# Altium schematic sheet iir_mcu.SchDoc
size A4; SheetNumber: 2; SheetTotal: 2
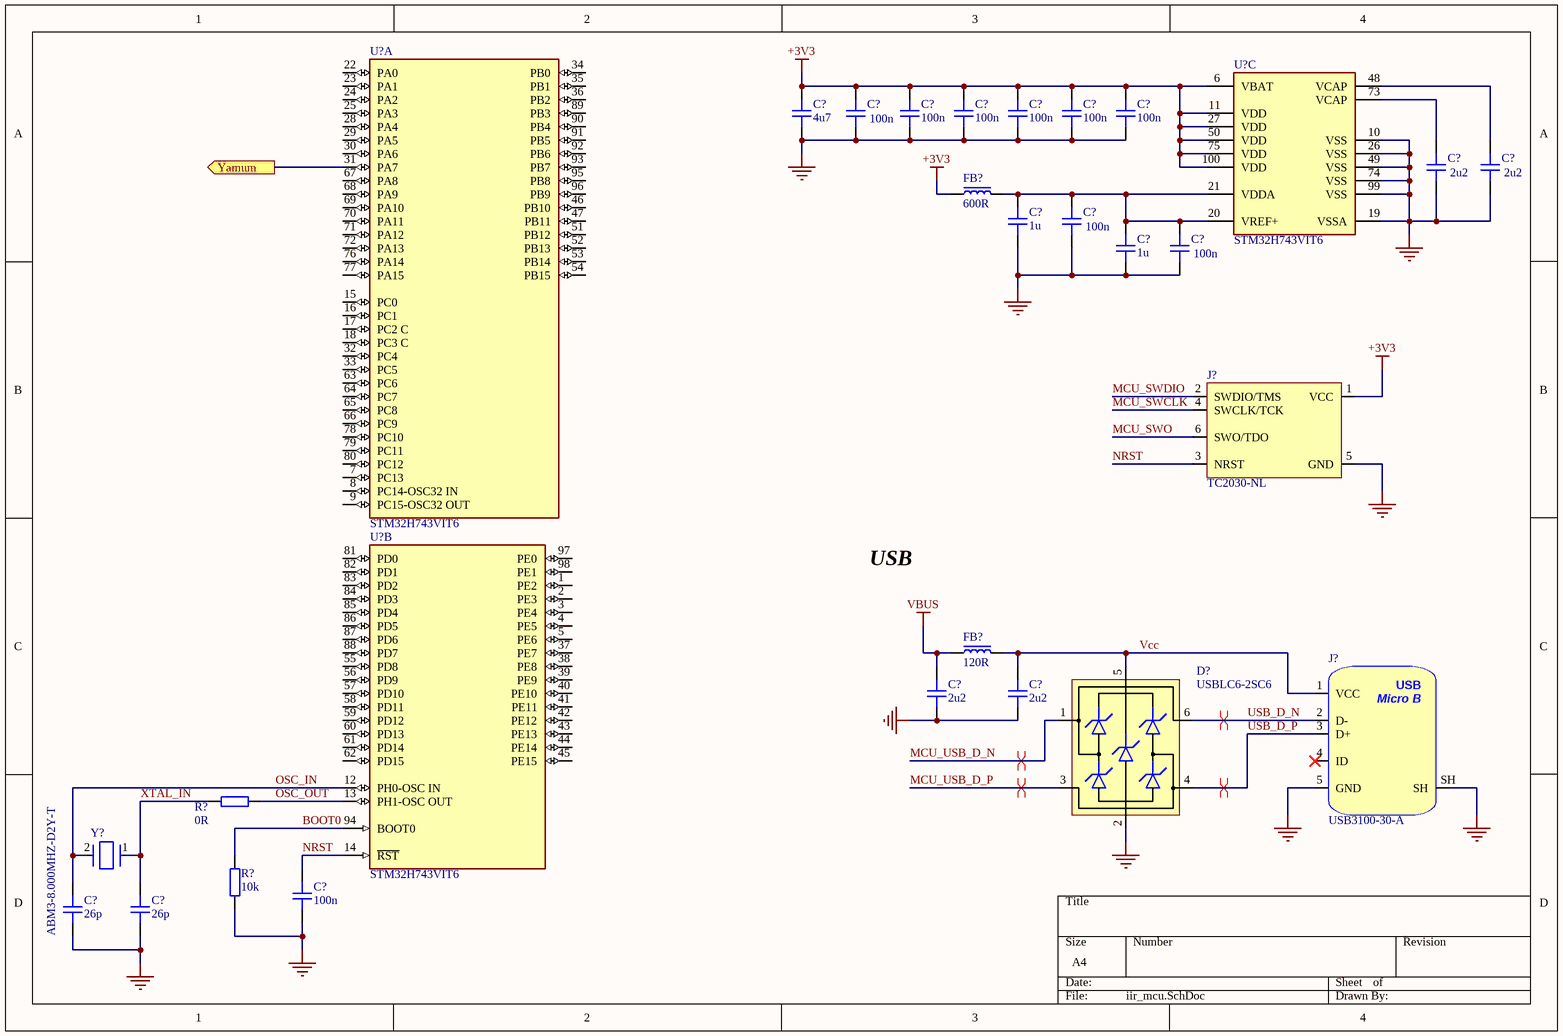
[diagram p0: iir_mcu.SchDoc]

## Parts
(Parts that share a designator on the sheet are numbered #1, #2 ... from top to bottom, then left to right.)
C?#1  4u7  [CAP_0603]
C?#2  100n  [CAP_0402]
C?#3  100n  [CAP_0402]
C?#4  100n  [CAP_0402]
C?#5  100n  [CAP_0402]
C?#6  100n  [CAP_0402]
C?#7  100n  [CAP_0402]
C?#8  2u2  [CAP_0402]
C?#9  2u2  [CAP_0402]
C?#10  1u  [CAP_0603]
C?#11  100n  [CAP_0402]
C?#12  1u  [CAP_0603]
C?#13  100n  [CAP_0402]
C?#14  2u2  [CAP_0603]
C?#15  2u2  [CAP_0603]
C?#16  100n  [CAP_0402]
C?#17  26p  [CAP_0402]
C?#18  26p  [CAP_0402]
D?  USBLC6-2SC6  [SOT-23-6]
FB?#1  600R  [FB_0805]
FB?#2  120R  [FB_0603]
J?#1  TC2030-NL  [TC2030-NL-FP]  (no BOM)
J?#2  USB3100-30-A  [USB3100-30-A]
R?#1  0R  [RES_0402]
R?#2  10k  [RES_0402]
U?#1  STM32H743VIT6  [FP-LQFP100-1L-MFG]  (part A of 3)
U?#2  STM32H743VIT6  [FP-LQFP100-1L-MFG]  (part C of 3)
U?#3  STM32H743VIT6  [FP-LQFP100-1L-MFG]  (part B of 3)
Y?  ABM3-8.000MHZ-D2Y-T  [FP-ABM3-MFG]

## Ports
Yamum (out)

## Nets
+3V3: C?#1.2 C?#2.2 C?#3.2 C?#4.2 C?#5.2 C?#6.2 C?#7.2 FB?#1.1 J?#1.1(VCC) U?#2.6(VBAT) U?#2.11(VDD) U?#2.27(VDD) U?#2.50(VDD) U?#2.75(VDD) U?#2.100(VDD)
GND: C?#1.1 C?#2.1 C?#3.1 C?#4.1 C?#5.1 C?#6.1 C?#7.1 C?#8.1 C?#9.1 C?#10.1 C?#11.1 C?#12.1 C?#13.1 C?#14.1 C?#15.1 C?#16.1 C?#17.1 C?#18.1 D?.2(GND) J?#1.5(GND) J?#2.5(GND) J?#2.SH R?#2.1 U?#2.10(VSS) U?#2.19(VSSA) U?#2.26(VSS) U?#2.49(VSS) U?#2.74(VSS) U?#2.99(VSS)
VBUS: C?#14.2 FB?#2.1
BOOT0: R?#2.2 U?#3.94(BOOT0)
MCU_SWCLK: J?#1.4(SWCLK/TCK)
MCU_SWDIO: J?#1.2(SWDIO/TMS)
MCU_SWO: J?#1.6(SWO/TDO)
MCU_USB_D_N: D?.1(IO1)
MCU_USB_D_P: D?.3(IO2)
NRST: C?#16.2 J?#1.3(NRST) U?#3.14(~{RST})
OSC_IN: C?#17.2 U?#3.12(PH0-OSC_IN) Y?.2
OSC_OUT: R?#1.2 U?#3.13(PH1-OSC_OUT)
USB_D_N: D?.6(IO1) J?#2.2(D-)
USB_D_P: D?.4(IO2) J?#2.3(D+)
Vcc: C?#15.2 D?.5(VBUS) FB?#2.2 J?#2.1(VCC)
XTAL_IN: C?#18.2 R?#1.1 Y?.1
Yamum: U?#1.31(PA7) ; port Yamum
NetC?#8_2: C?#8.2 U?#2.73(VCAP)
NetC?#9_2: C?#9.2 U?#2.48(VCAP)
NetC?#10_2: C?#10.2 C?#11.2 C?#12.2 C?#13.2 FB?#1.2 U?#2.20(VREF+) U?#2.21(VDDA)

Not connected (* = marked no-connect by the designer): J?#2 4(ID)*; U?#1 7(PC13) 8(PC14-OSC32_IN) 9(PC15-OSC32_OUT) 15(PC0) 16(PC1) 17(PC2_C) 18(PC3_C) 22(PA0) 23(PA1) 24(PA2) 25(PA3) 28(PA4) 29(PA5) 30(PA6) 32(PC4) 33(PC5) 34(PB0) 35(PB1) 36(PB2) 46(PB10) 47(PB11) 51(PB12) 52(PB13) 53(PB14) 54(PB15) 63(PC6) 64(PC7) 65(PC8) 66(PC9) 67(PA8) 68(PA9) 69(PA10) 70(PA11) 71(PA12) 72(PA13) 76(PA14) 77(PA15) 78(PC10) 79(PC11) 80(PC12) 89(PB3) 90(PB4) 91(PB5) 92(PB6) 93(PB7) 95(PB8) 96(PB9); U?#3 1(PE2) 2(PE3) 3(PE4) 4(PE5) 5(PE6) 37(PE7) 38(PE8) 39(PE9) 40(PE10) 41(PE11) 42(PE12) 43(PE13) 44(PE14) 45(PE15) 55(PD8) 56(PD9) 57(PD10) 58(PD11) 59(PD12) 60(PD13) 61(PD14) 62(PD15) 81(PD0) 82(PD1) 83(PD2) 84(PD3) 85(PD4) 86(PD5) 87(PD6) 88(PD7) 97(PE0) 98(PE1)

## Layout directives
differential pair: MCU_USB_D_N, MCU_USB_D_P, USB_D_N, USB_D_P

## Notes on the sheet
- USB
- (in symbol USB3100-30-A) USB; Micro B

## Library data of the parts
C?#1 C?#10 C?#12 C?#14 C?#15 = CAP_0603: 16V; Manufacturer: *; Manufacturer Part Number: *; Distributor Link: *; LCSC: *; Rating: *; Dielectric: *
C?#2-C?#9 C?#11 C?#13 C?#16 = CAP_0402: 16V; Manufacturer: *; Manufacturer Part Number: *; Distributor Link: *; LCSC: *; Rating: *; Dielectric: *
C?#17 C?#18 = CAP_0402: Capacitor SMD 0402; Manufacturer: *; Manufacturer Part Number: *; Distributor Link: *; LCSC: *; Rating: *; Dielectric: *
D? = USBLC6-2SC6: Low-Capacitance ESD Protection USB; Manufacturer: STMicroelectronics; Manufacturer Part Number: USBLC6-2SC6; Distributor Link: https://www.mouser.de/ProductDetail/STMicroelectronics/USBLC6-2SC6?qs=po45yt2pPpu%2FhNIlwQdTlg%3D%3D
FB?#1 = FB_0805: 300mOhm DC, 600R @ 100MHz; Manufacturer: *; Manufacturer Part Number: *; Distributor Link: *; LCSC: *
FB?#2 = FB_0603: 30mOhm; Manufacturer: *; Manufacturer Part Number: *; Distributor Link: *; LCSC: *
J?#1 = TC2030-NL: Tag-Connect No-Solder SWD Debug Connector (No Legs) DO NOT PLACE; Manufacturer: Tag-Connect; Manufacturer Part Number: TC2030-NL-FP
J?#2 = USB3100-30-A: USB Connector Type Micro B 2.0 SMD Reverse Mount; Manufacturer: GCT; Manufacturer Part Number: USB3100-30-A
R?#1 R?#2 = RES_0402: Resistor SMD 0402; Manufacturer: *; Manufacturer Part Number: *; Distributor Link: *; LCSC: *
U?#1-U?#3 = CMP-12105-000050-1: IC MCU 32BIT 2MB FLASH 100LQFP; Manufacturer: STMicroelectronics; Number Of Ethernet Channels: 1; Number Of Usb Channels: 2; Number Of A/D Converters: 3; Min Supply Voltage: 1.71V; Ram Size: 1060KBytes; Description: ARM® Cortex®-M7 STM32H7 Microcontroller IC 32-Bit 400MHz 2MB (2M x 8) FLASH 100-LQFP (14x14); Number Of I2C Channels: 4; Frequency: 480MHz; Number Of Adc Channels: 36; Number Of I/Os: 82; Max Supply Voltage: 3.6V; Number Of Spi Channels: 6; Memory Size: 2MBytes; Max Junction Temp: +125°C; Core Architecture: Arm Cortex-M7; Interface: I2C,SPI,UART,USART,USB,LIN,IrDA,Ethernet,I2S,Other; Number Of Timers/Counters: 20; Data Bus Width: 32bits; Number Of Pwm Channels: 42; Number Of Uart Channels: 9; Standoff Height: 0.05mm; Device Class L1: Integrated Circuits (ICs); ComponentLink2URL: https://www.st.com/resource/en/datasheet/stm32h743vi.pdf; Automotive: No; Memory Type: FLASH; Number Of Cores: 1; Temperature Range Low: -40°C; RoHS: TRUE; Ambient Temperature Range Low: -40°C; ComponentLink2Description: Datasheet; Device Class L2: Embedded Processors and Controllers; Device Class L3: Microcontrollers; Digikey Description: IC MCU 32BIT 2MB FLASH 100LQFP; Temperature Range High: +125°C; Ambient Temperature Range High: +85°C; Package: LQFP100-1L; Temperature: -40°C to +125°C; Category: IC; Ipc Land Pattern Name: QFP50P1600X1600X160-100; Height: 1.6mm; Manufacturer Part Number: STM32H743VIT6; Octopart: https://octopart.com/stm32h743vit6-stmicroelectronics-76372527; Lead Free: Yes
Y? = CMP-2000-05033-2: Crystal 8MHz ±20ppm 18pF SMD-2 5mm x 3.2mm; Series Resistance: 500R; Frequency Stability: 30ppm; ESR (Equivalent Series Resistance): 140R; Load Capacitance: 18pF; Height: 0.051inch; Tolerance: 20ppm; Depth: 3.2mm; Max Operating Temperature: 85°C; Frequency: 8MHz; Termination: SMD/SMT; Lead Free: Lead Free; Number of Pins: 2; Width: 3.2mm; RoHS Compliant: Yes; Resistor Type: Ceramic; Length: 5mm; Mount: Surface Mount; Case/Package: CSMD; Package Quantity: 1000; Radiation Hardening: No; Min Operating Temperature: -40°C; Packaging: Tape and Reel; Frequency Tolerance: 20ppm